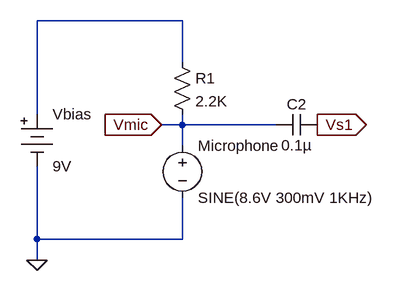
[diagram p0: schematic Draft1.asc]
Draft1.asc, the LTspice schematic file:
Version 4
SHEET 1 1044 680
WIRE 352 96 128 96
WIRE 352 160 352 96
WIRE 128 240 128 96
WIRE 352 256 352 240
WIRE 352 256 320 256
WIRE 496 256 352 256
WIRE 352 288 352 256
WIRE 128 432 128 320
WIRE 352 432 352 368
WIRE 352 432 128 432
WIRE 128 464 128 432
FLAG 320 256 Vmic
IOPIN 320 256 In
FLAG 128 464 0
FLAG 560 256 Vs1
IOPIN 560 256 Out
SYMBOL res 336 144 R0
SYMATTR InstName R1
SYMATTR Value 2.2K
SYMBOL voltage 352 272 R0
SYMATTR InstName Microphone
SYMATTR Value SINE(8.6V 300mV 1KHz)
SYMBOL Misc/battery 128 224 R0
SYMATTR InstName Vbias
SYMATTR Value 9V
SYMBOL cap 560 240 R90
WINDOW 0 0 32 VBottom 2
WINDOW 3 32 32 VTop 2
SYMATTR InstName C2
SYMATTR Value 0.1µ

The netlist it stands for:
* Draft1.asc
R1 N001 Vmic 2.2K
V§Microphone Vmic 0 SINE(8.6V 300mV 1KHz)
Vbias N001 0 9V
C2 Vs1 Vmic 0.1µ
.backanno
.end